# EAGLE design 20223 (EAGLE 7.6.0)
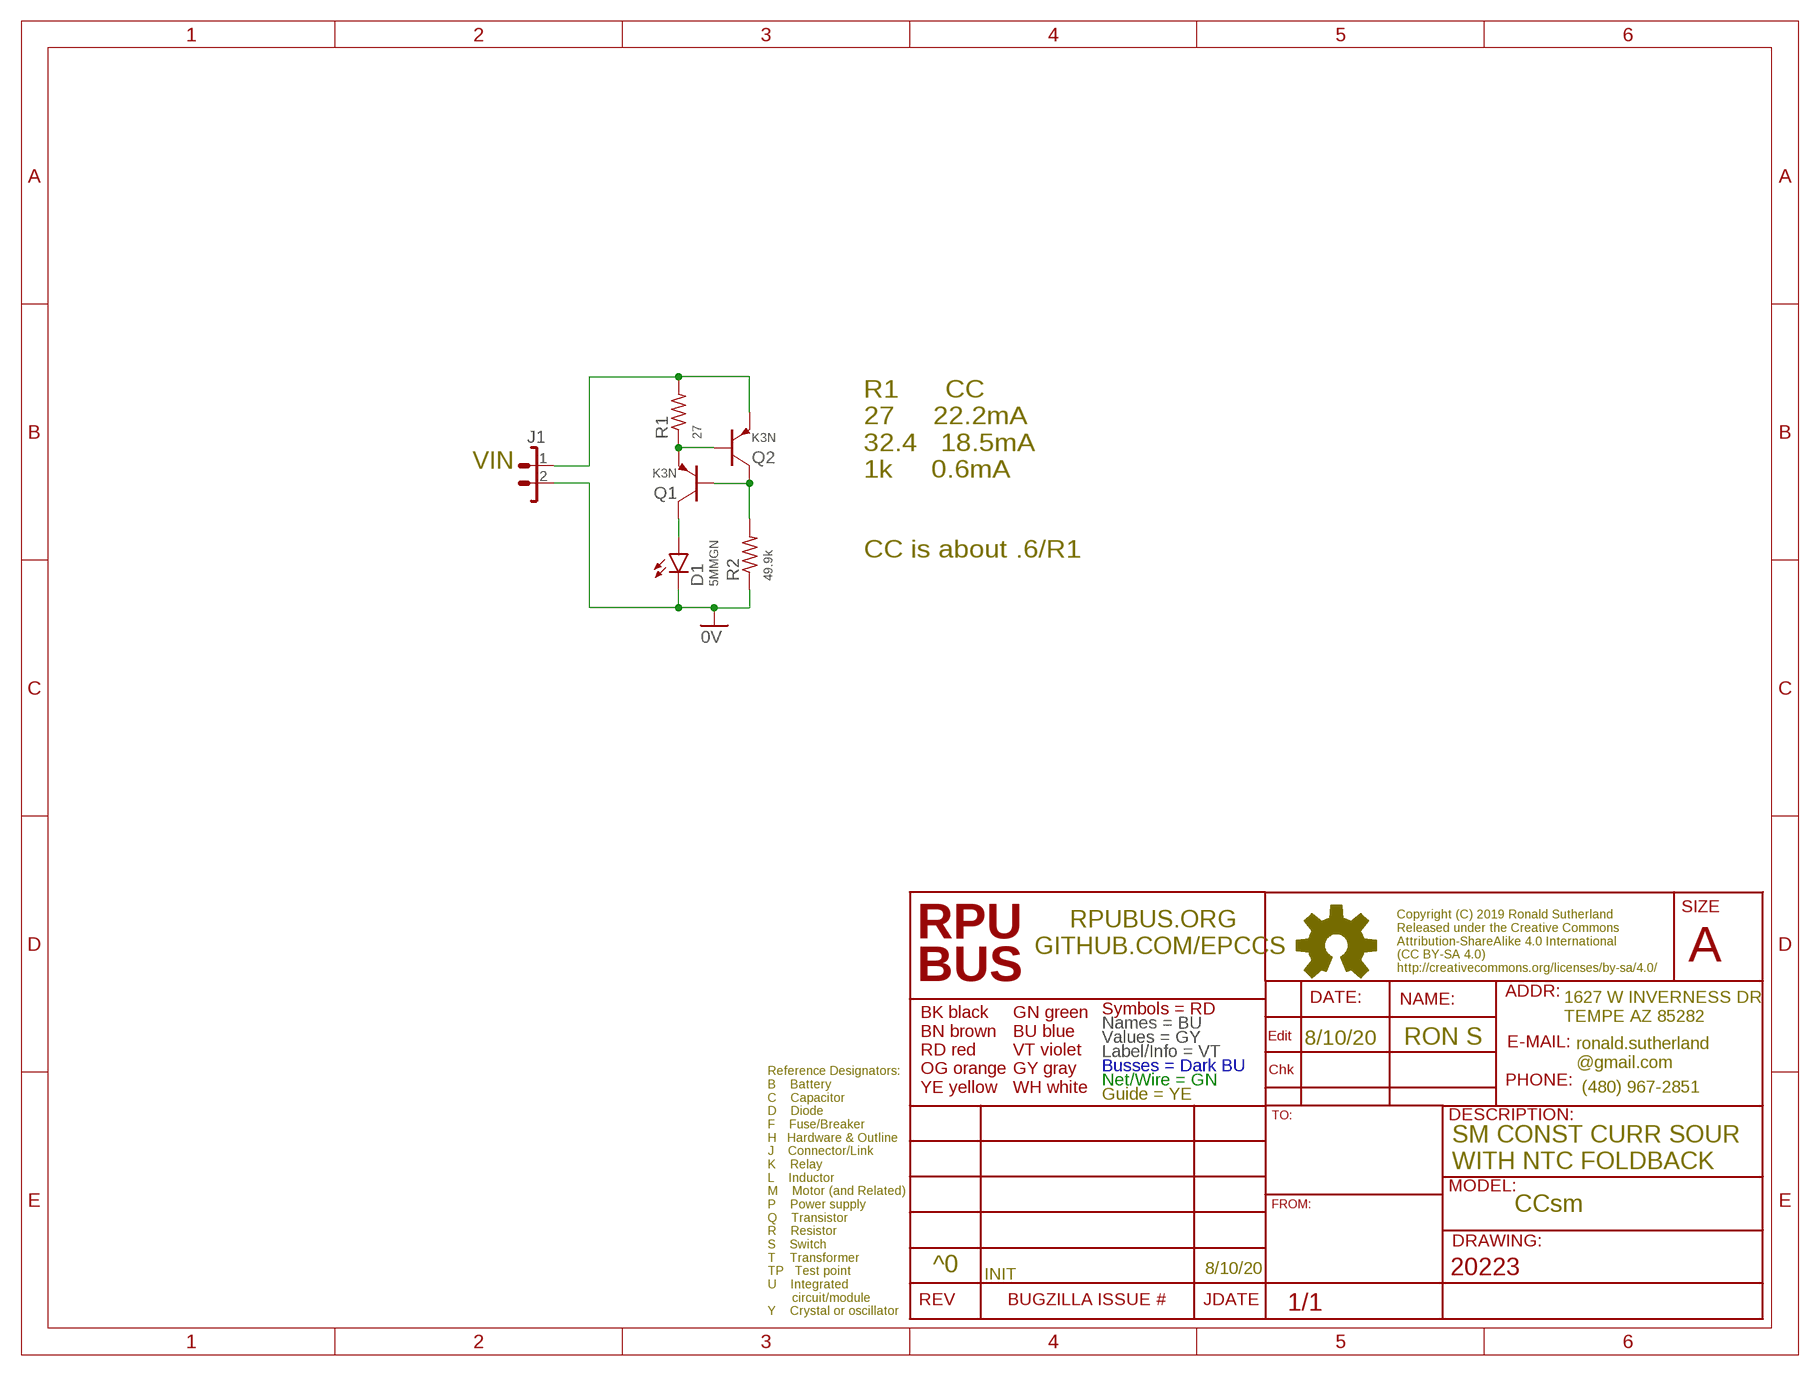
[diagram p0: schematic, sheet 1]

## Parts
D1  5MMGN  LED5MM  [LED5MM]
J1  1X2  [1X2]
Q1  K3N  PNPSOT23  [SOT23]
Q2  K3N  PNPSOT23  [SOT23]
R1  27  R0805  [C0805(2012)]
R2  49.9k  R0805  [C0805(2012)]

## Nets
0V: D1.K J1.2 R2.1
N$5: Q1.B Q2.C R2.2
N$6: J1.1 Q2.E R1.2
N$7: D1.A Q1.C
N$10: Q1.E Q2.B R1.1

## Notes on the sheet
- VIN
- R1      CC
  27     22.2mA
  32.4   18.5mA
  1k     0.6mA
  
  
  CC is about .6/R1
- 8/10/20 | RON S
- SM CONST CURR SOUR
  WITH NTC FOLDBACK
- CCsm
- ^0 | 8/10/20
- INIT

## Library data of the parts
D1 = D-LED:LED: LED 120120WH [CREE,XHGAWT-00-0000-00000HXE1] LED WHITE 6500K 150LUM-W120120
J1 = J-HDR2.54mm:1X2
Q1 Q2 = Q-PNP:PNP: BJT NPN General Purpose Amplifier
R1 R2 = R-C:R: Resiistor American-style symbol

## Net classes
0 default: width 0.178 mm, drill 0.33 mm

## Board
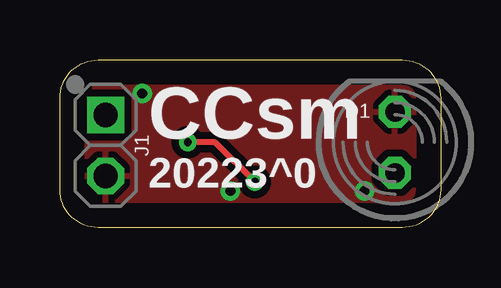
[diagram p1: board, top side]
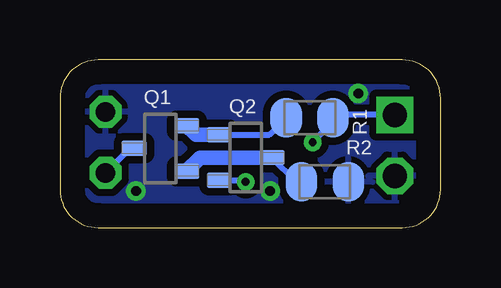
[diagram p2: board, bottom side, seen from below]

Size 15.88 x 6.99 mm. Coordinates in mm from the lower left corner, seen from the top.
Outline: 15.88,5.4 15.88,1.59 arc-90 14.29,0 1.59,0 arc-90 0,1.59 0,5.4 arc-90 1.59,6.99 14.29,6.99 arc-90 15.88,5.4
Copper layers (1*16): Top 0.034290625mm / dielectric 60mil / Bottom 0.034290625mm
Design rules "default *": minimum track width 10mil, minimum drill 13mil, track to track 8mil, track to pad 8mil, pad to pad 8mil, via to via 8mil, smd to smd 8mil, copper to edge 40mil, drill to drill 12mil, minimum pad ring 10mil, minimum via ring 8mil, stop-mask expansion 4mil, vias tented up to drill 17mil, thermal gap 10mil

### Footprints (pad centres in the part's own frame; a part is rotated, then mirrored left to right if it is on the bottom)
LED5MM = drill 0.813 octagon: A -1.27,0; K 1.27,0
1X2 = drill 1.016 square: 1 0,0 | drill 1.016 octagon: 2 2.54,0
SOT23 = smd 0.65 x 1.06: B -0.95,-1.1; C 0,1.1; E 0.95,-1.1
C0805(2012) = smd 1.321 x 1.651: 1 -0.977,0; 2 0.977,0

### Placement (x,y rotation side)
D1  13.97,3.56 90 top
J1  1.91,4.7 270 top
Q1  11.68,3.3 90 bottom
Q2  8.13,2.92 270 bottom
R1  5.46,4.57 0 bottom
R2  4.83,1.91 180 bottom

### Tracks (layer width: path | path; a pad name or v marks a point on that pad's centre or on a via)
0V  (via drill 0.41)
  other vias: 7.11,1.52 3.43,5.59 12.7,1.52
  pour Top (isolate 0.305): 15.88,0 0,0 0,6.99 15.88,6.99
  pour Bottom (isolate 0.305): 0,6.99 15.88,6.99 15.88,0 0,0
N$5
  Bottom 0.254: R2.2 6.01,1.91 Q2.C
  Bottom 0.61: Q1.B 10.58,2.37 10.03,2.92 Q2.C
N$6  (via drill 0.33)
  Top 0.254: v8.13,1.91 6.48,3.56 v5.33,3.56
  Bottom 0.254: Q2.E 8.19,1.97 v8.13,1.91 | v5.33,3.56 4.48,4.41 R1.2 4.61,4.7 J1.1
N$7
  Bottom 0.254: Q1.C 12.95,3.3 D1.A
N$10
  Bottom 0.254: Q2.B 7.14,3.87 R1.1
  Bottom 0.61: Q2.B 10.2,3.87 Q1.E

### Text on the board
tPlace: CCsm | 20223^0